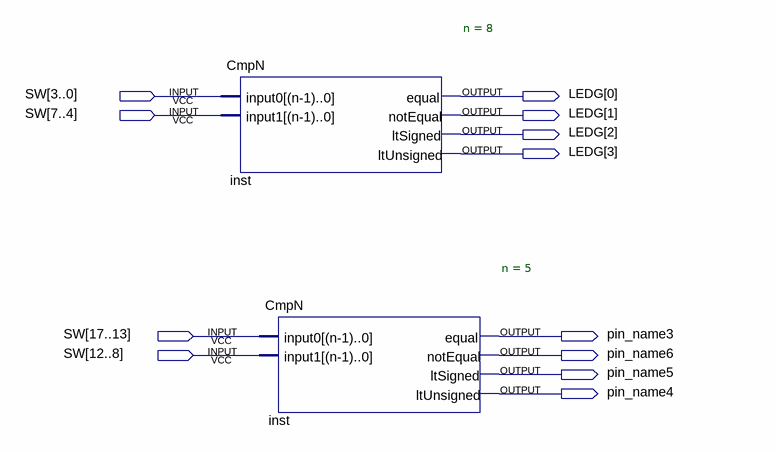
[diagram p0: schematic sheet]
// Quartus schematic CmpN_Demo.bdf as structural Verilog: 2 symbols, 12 pins
module CmpN_Demo (
  input  [17:0] SW,
  output [3:0] LEDG,
  output pin_name3,
  output pin_name6,
  output pin_name5,
  output pin_name4
);

  CmpN #(.n(8)) inst (
    .input0(SW[3:0]), .input1(SW[7:4]), .equal(LEDG[0]), .notEqual(LEDG[1]), .ltSigned(LEDG[2]),
    .ltUnsigned(LEDG[3]));
  CmpN #(.n(5)) inst_dup2 (
    .input0(SW[17:13]), .input1(SW[12:8]), .equal(pin_name3), .notEqual(pin_name6), .ltSigned(pin_name5),
    .ltUnsigned(pin_name4));
endmodule
